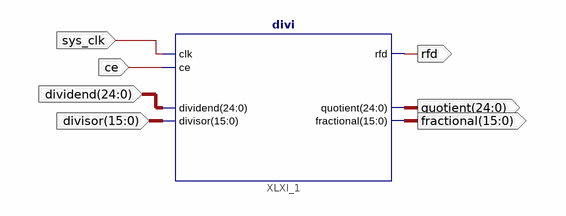
[diagram p0: schematic sheet 1]
// Xilinx ISE schematic divi_top.sch (spartan3a) as structural Verilog: 1 symbols, 7 ports
module divi_top (
  input  sys_clk,
  input  [24:0] dividend,
  input  [15:0] divisor,
  input  ce,
  output [24:0] quotient,
  output [15:0] fractional,
  output rfd
);

  divi XLXI_1 (
    .clk(sys_clk), .ce(ce), .dividend(dividend), .divisor(divisor), .rfd(rfd), .quotient(quotient),
    .fractional(fractional));
endmodule
